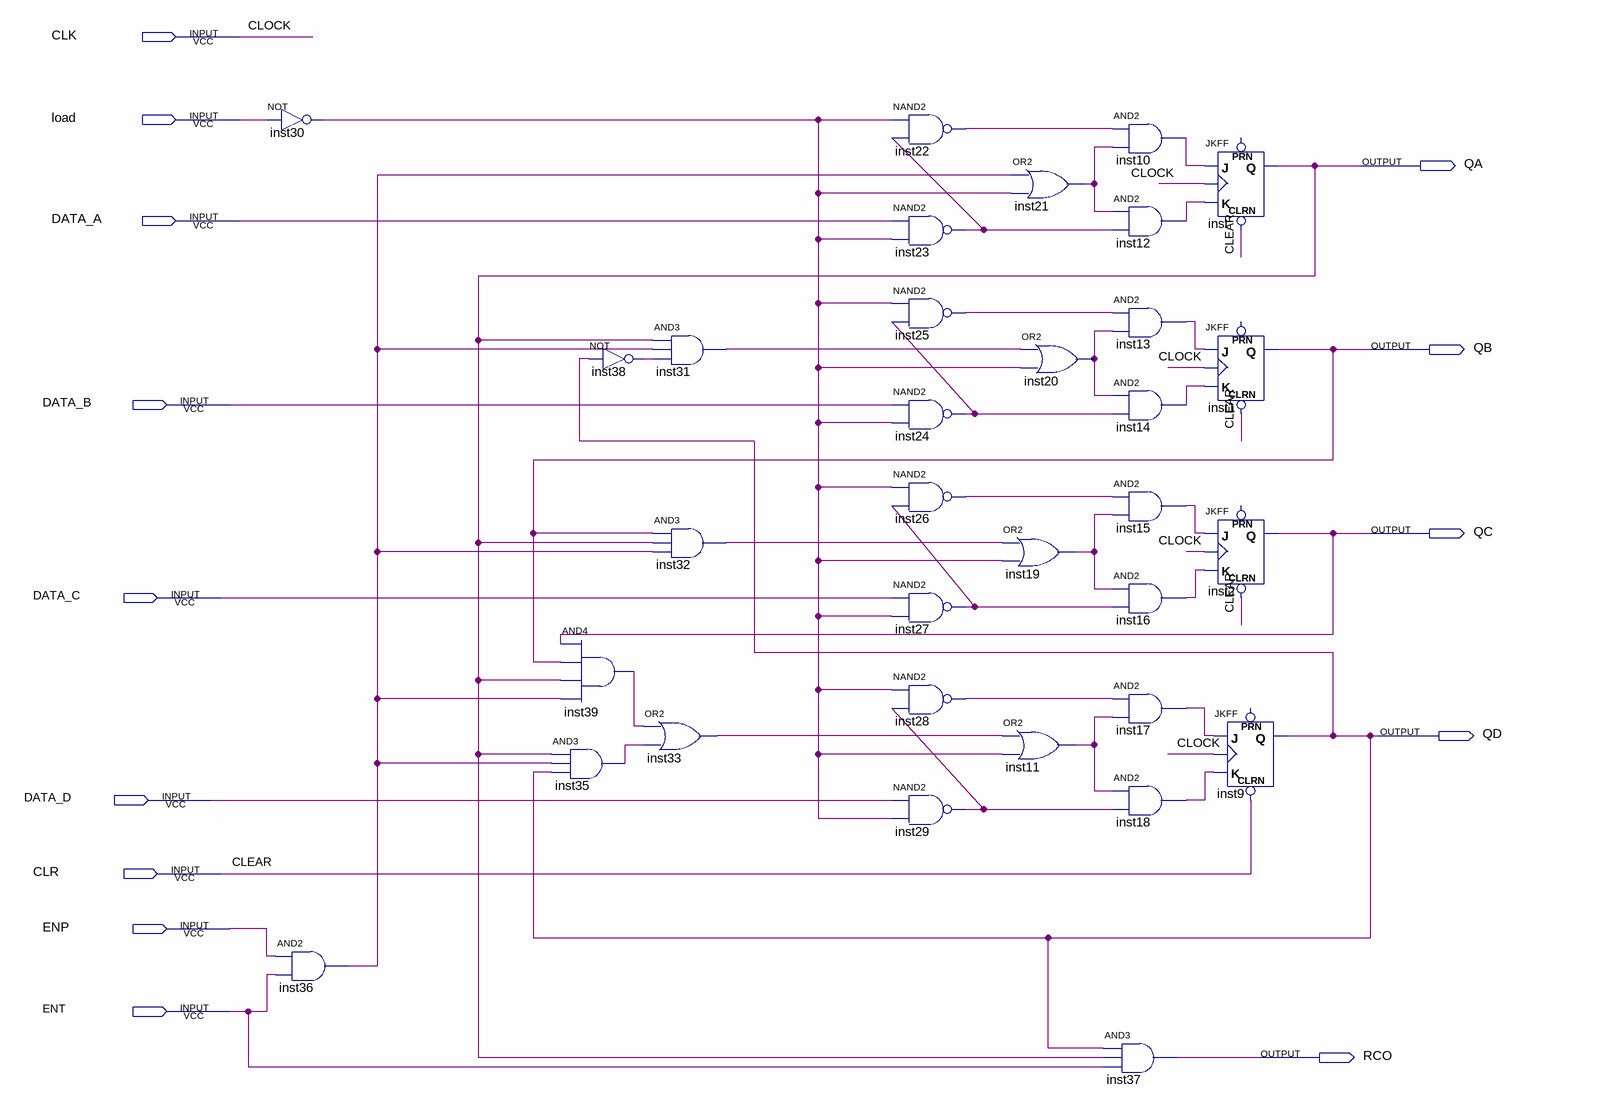
[diagram p0: schematic sheet]
// Quartus schematic CI74LS161_CONTADOR_SINCRONO_4BITS.bdf as structural Verilog: 33 symbols, 14 pins
module CI74LS161_CONTADOR_SINCRONO_4BITS (
  input  CLK,
  input  load,
  input  DATA_A,
  input  DATA_B,
  input  DATA_C,
  input  DATA_D,
  input  CLR,
  input  ENP,
  input  ENT,
  output QA,
  output QB,
  output QC,
  output QD,
  output RCO
);

  wire inst10_out, inst11_out, inst12_out, inst13_out, inst14_out, inst15_out, inst16_out, inst17_out,
       inst18_out, inst19_out, inst20_out, inst21_out, inst22_out, inst23_out, inst24_out, inst25_out,
       inst26_out, inst27_out, inst28_out, inst29_out, inst30_out, inst31_out, inst32_out, inst33_out,
       inst35_out, inst36_out, inst38_out, inst39_out;

  not inst30 (inst30_out, load);
  and inst36 (inst36_out, ENP, ENT);
  and inst39 (inst39_out, QC, QB, QA, inst36_out);
  and inst35 (inst35_out, QA, inst36_out, QD);
  not inst38 (inst38_out, QD);
  or inst33 (inst33_out, inst39_out, inst35_out);
  and inst31 (inst31_out, QA, inst36_out, inst38_out);
  and inst32 (inst32_out, QB, QA, inst36_out);
  nand inst22 (inst22_out, inst30_out, inst23_out);
  nand inst23 (inst23_out, DATA_A, inst30_out);
  nand inst25 (inst25_out, inst30_out, inst24_out);
  nand inst24 (inst24_out, DATA_B, inst30_out);
  nand inst26 (inst26_out, inst30_out, inst27_out);
  nand inst27 (inst27_out, DATA_C, inst30_out);
  nand inst28 (inst28_out, inst30_out, inst29_out);
  nand inst29 (inst29_out, DATA_D, inst30_out);
  or inst21 (inst21_out, inst36_out, inst30_out);
  or inst19 (inst19_out, inst32_out, inst30_out);
  or inst11 (inst11_out, inst33_out, inst30_out);
  or inst20 (inst20_out, inst31_out, inst30_out);
  and inst10 (inst10_out, inst22_out, inst21_out);
  and inst12 (inst12_out, inst21_out, inst23_out);
  and inst13 (inst13_out, inst25_out, inst20_out);
  and inst14 (inst14_out, inst20_out, inst24_out);
  and inst15 (inst15_out, inst26_out, inst19_out);
  and inst16 (inst16_out, inst19_out, inst27_out);
  and inst17 (inst17_out, inst28_out, inst11_out);
  and inst18 (inst18_out, inst11_out, inst29_out);
  and inst37 (RCO, QD, QA, ENT);
  JKFF inst (.CLRN(CLR), .K(inst12_out), .J(inst10_out), .CLK(CLK), .Q(QA));  // open: PRN
  JKFF inst1 (.CLRN(CLR), .K(inst14_out), .J(inst13_out), .CLK(CLK), .Q(QB));  // open: PRN
  JKFF inst2 (.CLRN(CLR), .K(inst16_out), .J(inst15_out), .CLK(CLK), .Q(QC));  // open: PRN
  JKFF inst9 (.CLRN(CLR), .K(inst18_out), .J(inst17_out), .CLK(CLK), .Q(QD));  // open: PRN

  // Other names for the same wires on the sheet: CLEAR = CLR; CLOCK = CLK
endmodule
